# Altium schematic sheet LCD_Connectors.SchDoc
size A4; SheetNumber: 3; SheetTotal: 3
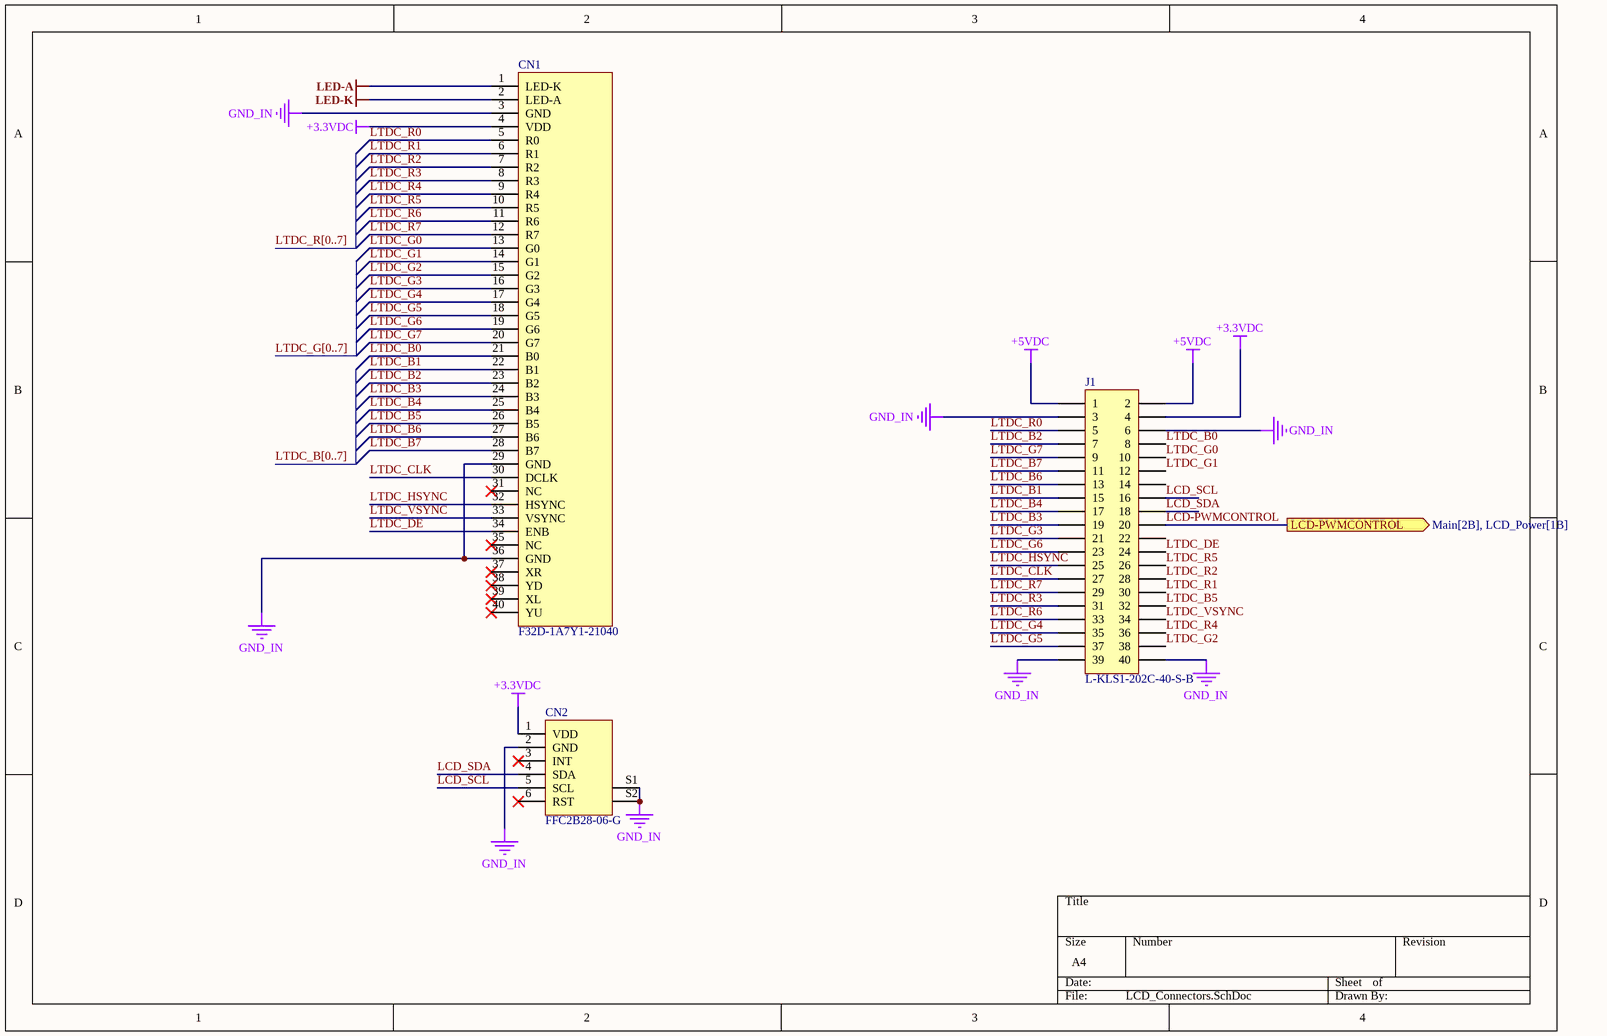
[diagram p0: LCD_Connectors.SchDoc]

## Parts
CN1  F32D-1A7Y1-21040  [FPC_40POS_DOUBLESIDE]
CN2  FFC2B28-06-G  [FPC_6POS_DOUBLESIDE]
J1  L-KLS1-202C-40-S-B  [L-KLS1-202C-40-T-B]

## Ports
LCD-PWMCONTROL (out, see Main[2B], LCD_Power[1B])

## Nets
+3.3VDC: CN1.4(VDD) CN2.1(VDD) J1.4
+5VDC: J1.1 J1.2
GND_IN: CN1.3(GND) CN1.29(GND) CN1.36(GND) CN2.2(GND) CN2.S1(SHIELD) CN2.S2(SHIELD) J1.3 J1.6 J1.39 J1.40
LED-A: CN1.1(LED-K)
LED-K: CN1.2(LED-A)
LCD-PWMCONTROL: J1.20 ; port LCD-PWMCONTROL
LCD_SCL: CN2.5(SCL) J1.16
LCD_SDA: CN2.4(SDA) J1.18
LTDC_B0: CN1.21(B0) J1.8
LTDC_B1: CN1.22(B1) J1.15
LTDC_B2: CN1.23(B2) J1.7
LTDC_B3: CN1.24(B3) J1.19
LTDC_B4: CN1.25(B4) J1.17
LTDC_B5: CN1.26(B5) J1.32
LTDC_B6: CN1.27(B6) J1.13
LTDC_B7: CN1.28(B7) J1.11
LTDC_CLK: CN1.30(DCLK) J1.27
LTDC_DE: CN1.34(ENB) J1.24
LTDC_G0: CN1.13(G0) J1.10
LTDC_G1: CN1.14(G1) J1.12
LTDC_G2: CN1.15(G2) J1.38
LTDC_G3: CN1.16(G3) J1.21
LTDC_G4: CN1.17(G4) J1.35
LTDC_G5: CN1.18(G5) J1.37
LTDC_G6: CN1.19(G6) J1.23
LTDC_G7: CN1.20(G7) J1.9
LTDC_HSYNC: CN1.32(HSYNC) J1.25
LTDC_R0: CN1.5(R0) J1.5
LTDC_R1: CN1.6(R1) J1.30
LTDC_R2: CN1.7(R2) J1.28
LTDC_R3: CN1.8(R3) J1.31
LTDC_R4: CN1.9(R4) J1.36
LTDC_R5: CN1.10(R5) J1.26
LTDC_R6: CN1.11(R6) J1.33
LTDC_R7: CN1.12(R7) J1.29
LTDC_VSYNC: CN1.33(VSYNC) J1.34

Not connected (* = marked no-connect by the designer): CN1 31(NC)* 35(NC)* 37(XR)* 38(YD)* 39(XL)* 40(YU)*; CN2 3(INT)* 6(RST)*; J1 14 22

## Buses and harness runs
bus LTDC_B[0..7]
bus LTDC_G[0..7]
bus LTDC_R[0..7]

## Library data of the parts
CN1 = FPC CONN 40POS: CONN FFC BOTTOM 40POS 0.5MM R/A; Assembly: .; PN: F32D-1A7Y1-21040; Value: F32D-1A7Y1-21040; HelpURL: https://www.digikey.com/en/products/detail/amphenol-cs-fci/F32D-1A7Y1-21040/11564657?s=N4IgTCBcDaIGIGYwBEC0BGAggdgJrtTHQAYAWYkAXQF8g
CN2 = FPC CONN 6POS: Assembly: .; Value: FFC2B28-06-G; PN: FFC2B28-06-G; HelpURL: https://www.digikey.com/en/products/detail/gct/FFC2B28-06-G/12819956?s=N4IgTCBcDaIGJwMJgEJgBwFoAMA2TA4iALoC%2BQA
J1 = 2X20: BOX HEADER 40PIN(2x20) 1.27MM THT V/T MALE BLACK; Assembly: .; Value: L-KLS1-202C-40-S-B; PN: L-KLS1-202C-40-S-B; HelpURL: https://www.ozdisan.com/p/box-headerlar-295/kls-electronic-l-kls1-202c-40-s-b-531010